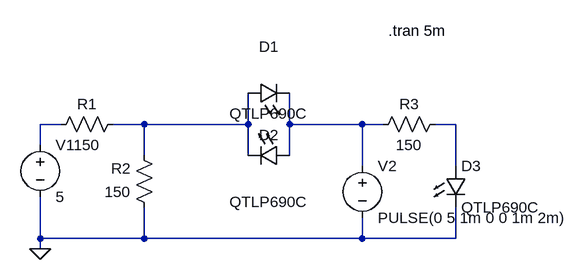
[diagram p0: schematic led-3.asc]
led-3.asc, the LTspice schematic file:
Version 4
SHEET 1 996 680
WIRE 192 304 160 304
WIRE 320 304 272 304
WIRE 480 304 480 256
WIRE 480 304 320 304
WIRE 544 304 544 256
WIRE 656 304 544 304
WIRE 688 304 656 304
WIRE 800 304 768 304
WIRE 160 336 160 304
WIRE 320 352 320 304
WIRE 480 352 480 304
WIRE 544 352 544 304
WIRE 656 368 656 304
WIRE 800 368 800 304
WIRE 160 480 160 416
WIRE 320 480 320 432
WIRE 320 480 160 480
WIRE 656 480 656 448
WIRE 656 480 320 480
WIRE 800 480 800 432
WIRE 800 480 656 480
WIRE 160 496 160 480
FLAG 160 496 0
SYMBOL LED 480 272 R270
WINDOW 0 72 32 VTop 2
WINDOW 3 0 32 VBottom 2
SYMATTR InstName D1
SYMATTR Value QTLP690C
SYMBOL LED 544 336 R90
WINDOW 0 0 32 VBottom 2
WINDOW 3 72 32 VTop 2
SYMATTR InstName D2
SYMATTR Value QTLP690C
SYMBOL voltage 656 352 R0
SYMATTR InstName V2
SYMATTR Value PULSE(0 5 1m 0 0 1m 2m)
SYMBOL voltage 160 320 R0
SYMATTR InstName V1
SYMATTR Value 5
SYMBOL res 288 288 R90
WINDOW 0 0 56 VBottom 2
WINDOW 3 32 56 VTop 2
SYMATTR InstName R1
SYMATTR Value 150
SYMBOL res 336 448 R180
WINDOW 0 36 76 Left 2
WINDOW 3 36 40 Left 2
SYMATTR InstName R2
SYMATTR Value 150
SYMBOL LED 784 368 R0
SYMATTR InstName D3
SYMATTR Value QTLP690C
SYMBOL res 672 320 R270
WINDOW 0 32 56 VTop 2
WINDOW 3 0 56 VBottom 2
SYMATTR InstName R3
SYMATTR Value 150
TEXT 696 160 Left 2 !.tran 5m

The netlist it stands for:
* led-3.asc
D1 N002 N003 QTLP690C
D2 N003 N002 QTLP690C
V2 N003 0 PULSE(0 5 1m 0 0 1m 2m)
V1 N001 0 5
R1 N002 N001 150
R2 0 N002 150
D3 N004 0 QTLP690C
R3 N003 N004 150
.model D D
.lib standard.dio
.tran 5m
.backanno
.end